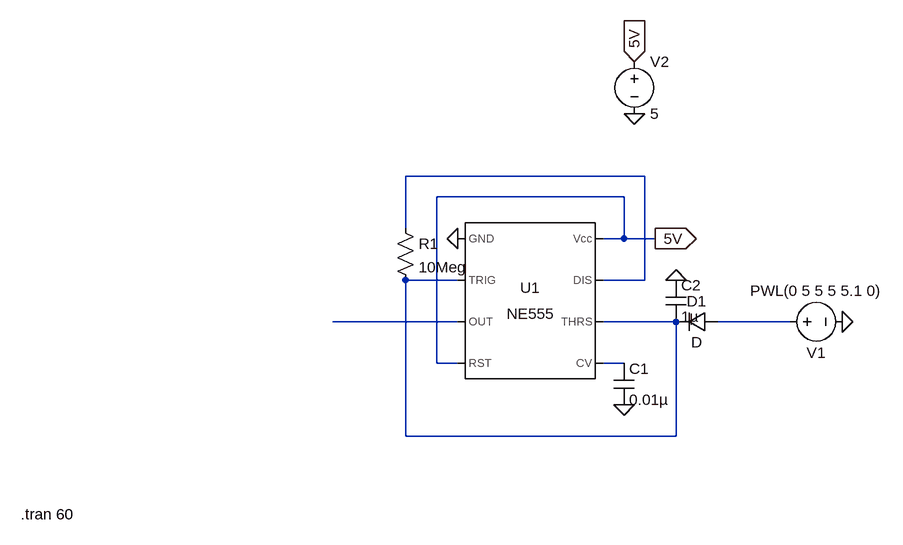
[diagram p0: schematic Oneshot.asc]
Oneshot.asc, the LTspice schematic file:
Version 4.1
SHEET 1 1080 680
WIRE 704 0 336 0
WIRE 672 32 384 32
WIRE 336 80 336 0
WIRE 672 96 672 32
WIRE 672 96 640 96
WIRE 720 96 672 96
WIRE 416 160 336 160
WIRE 704 160 704 0
WIRE 704 160 640 160
WIRE 416 224 224 224
WIRE 752 224 640 224
WIRE 928 224 816 224
WIRE 384 288 384 32
WIRE 416 288 384 288
WIRE 672 288 640 288
WIRE 336 400 336 160
WIRE 752 400 752 224
WIRE 752 400 336 400
FLAG 672 352 0
FLAG 688 -96 0
FLAG 688 -176 5V
IOPIN 688 -176 In
FLAG 720 96 5V
IOPIN 720 96 Out
FLAG 752 160 0
FLAG 1008 224 0
FLAG 416 96 0
SYMBOL voltage 912 224 R270
WINDOW 0 -32 56 VBottom 2
WINDOW 3 32 56 VTop 2
WINDOW 123 0 0 Left 0
WINDOW 39 0 0 Left 0
SYMATTR InstName V1
SYMATTR Value PWL(0 5 5 5 5.1 0)
SYMBOL Misc\\NE555 528 192 R0
SYMATTR InstName U1
SYMBOL cap 656 288 R0
SYMATTR InstName C1
SYMATTR Value 0.01µ
SYMATTR SpiceLine V=10 Irms=405m Rser=0.0322889 Lser=0 mfg="KEMET" pn="C0201C103K8PAC" type="X5R"
SYMBOL voltage 688 -192 R0
WINDOW 123 0 0 Left 0
WINDOW 39 0 0 Left 0
SYMATTR InstName V2
SYMATTR Value 5
SYMBOL cap 736 160 R0
SYMATTR InstName C2
SYMATTR Value 1µ
SYMATTR SpiceLine V=16 Irms=11 Rser=0.00378043 Lser=0
SYMBOL diode 816 208 R90
WINDOW 0 0 32 VBottom 2
WINDOW 3 32 32 VTop 2
SYMATTR InstName D1
SYMBOL res 320 64 R0
SYMATTR InstName R1
SYMATTR Value 10Meg
SYMATTR SpiceLine tol=1 pwr=0.1
TEXT -256 520 Left 2 !.tran 60

The netlist it stands for:
* Oneshot.asc
V1 N004 0 PWL(0 5 5 5 5.1 0)
X§U1 0 N002 N003 5V N005 N002 N001 5V NE555  ; pins GND TRIG OUT RST CV THRS DIS Vcc
C1 N005 0 0.01µ V=10 Irms=405m Rser=0.0322889 Lser=0 mfg="KEMET" pn="C0201C103K8PAC" type="X5R"
V2 5V 0 5
C2 0 N002 1µ V=16 Irms=11 Rser=0.00378043 Lser=0
D1 N004 N002 D
R1 N001 N002 10Meg tol=1 pwr=0.1
.model D D
.lib standard.dio
.tran 60
.lib NE555.sub
.backanno
.end